# Altium schematic sheet Sheet_1_2025-11-25.schdoc
size 116 x 64 mm
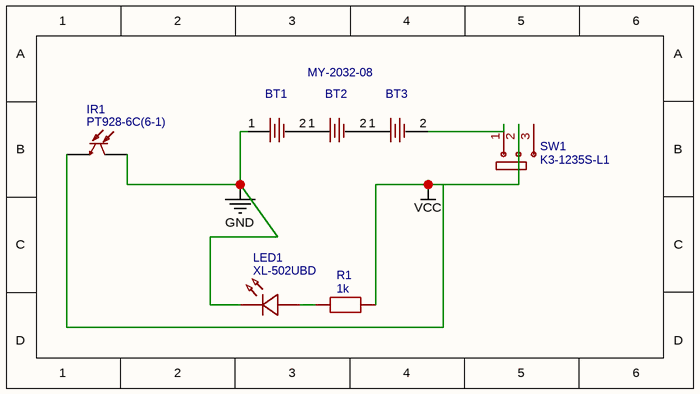
[diagram p0: Sheet_1_2025-11-25.schdoc]

## Parts
BT1  MY-2032-08  [BAT-SMD_MY-2032-08]  (value not drawn)
BT2  MY-2032-08  [BAT-SMD_MY-2032-08]
BT3  MY-2032-08  [BAT-SMD_MY-2032-08]  (value not drawn)
IR1  PT928-6C(6-1)  [LED-TH_L4.5-W1.5-P2.54-RD]
LED1  XL-502UBD  [LED-TH_BD5.9-P2.54-RD_BLUE]
R1  1k  [R0603]
SW1  K3-1235S-L1  [SW-TH_K3-1235S-L1]

## Nets
GND: BT1.1 IR1.2(C) LED1.1(K)
VCC: IR1.1(E) R1.2 SW1.2
NetBT1_2: BT1.2 BT2.1
NetBT2_2: BT2.2 BT3.1
NetBT3_2: BT3.2 SW1.1
NetLED1_2: LED1.2(A) R1.1

Not connected (* = marked no-connect by the designer): SW1 3

## Library data of the parts
BT1-BT3 = MY-2032-08: Manufacturer: MYOUNG(美阳); Contributor: LCSC; Supplier: LCSC; Supplier Part: C964831; Manufacturer Part: MY-2032-08; JLCPCB Part Class: Extended Part; spicePre: B; spiceSymbolName: MY-2032-08
IR1 = PT928-6C(6-1): Manufacturer: EVERLIGHT(亿光); Supplier: LCSC; Manufacturer Part: PT928-6C(6-1); Supplier Part: C72049; JLCPCB Part Class: Extended Part; spicePre: I; spiceSymbolName: PT928-6C(6-1)
LED1 = XL-502UBD: Manufacturer: XINGLIGHT(成兴光); Contributor: lcsc; Supplier: LCSC; Supplier Part: C2895496; Manufacturer Part: XL-502UBD; JLCPCB Part Class: Extended Part; spicePre: L; spiceSymbolName: XL-502UBD
R1 = 1k: nameAlias: Value(Ω); Contributor: LCEDA_Lib; spicePre: R; spiceSymbolName: R_0603_EU
SW1 = K3-1235S-L1: Manufacturer: 韩国韩荣; Contributor: LCSC; Supplier: LCSC; Supplier Part: C223838; Manufacturer Part: K3-1235S-L1; JLCPCB Part Class: Extended Part; spicePre: S; spiceSymbolName: K3-1235S-L1